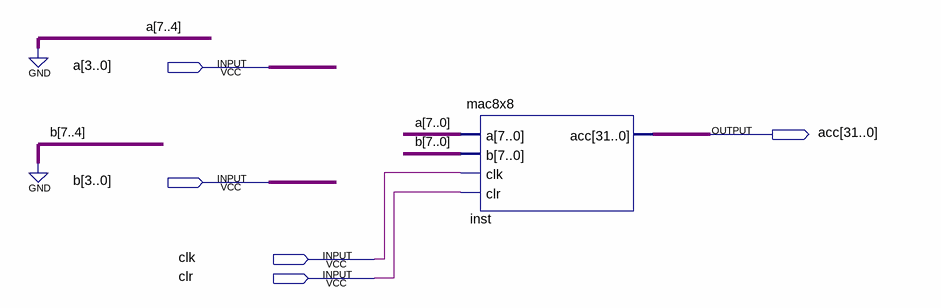
[diagram p0: schematic sheet]
// Quartus schematic Lab5.bdf as structural Verilog: 1 symbols, 5 pins
module Lab5 (
  input  [3:0] a,
  input  [3:0] b,
  input  clk,
  input  clr,
  output [31:0] acc
);

  mac8x8 inst (.a({4'b0000, a}), .b({4'b0000, b}), .clk(clk), .clr(clr), .acc(acc));
endmodule
